# Altium project ArmPCBPrj.PrjPCB
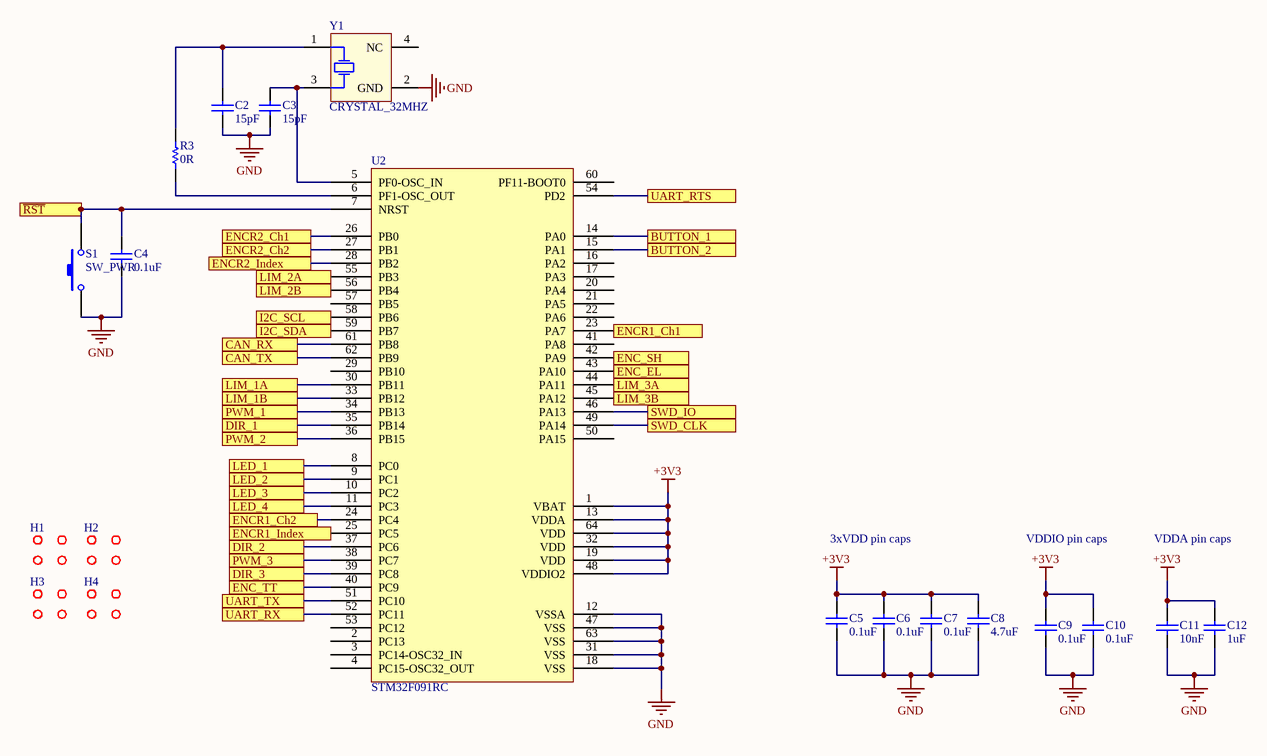
[diagram p0: MCU.SchDoc]
4 sheets, 54 parts. Net scope: flat (ports and power ports of the same name join across sheets).
Board files: ArmPCB.PcbDoc, ArmRev2.PcbDoc
Sheets:
  MCU.SchDoc
  CAN.SchDoc
  POWER.SchDoc
  Connectors.SchDoc

## Sheet MCU.SchDoc
size A4

### Parts
C2  value 15pF  [CAPC0603(1608)55_N]  (hidden comment: CAP_15pF_0603)
C3  value 15pF  [CAPC0603(1608)55_N]  (hidden comment: CAP_15pF_0603)
C4  value 0.1uF  [CAPC0603(1608)55_N]  (hidden comment: CAP_0.1uF_16V_0603)
C5  value 0.1uF  [CAPC0603(1608)55_N]  (hidden comment: CAP_0.1uF_16V_0603)
C6  value 0.1uF  [CAPC0603(1608)55_N]  (hidden comment: CAP_0.1uF_16V_0603)
C7  value 0.1uF  [CAPC0603(1608)55_N]  (hidden comment: CAP_0.1uF_16V_0603)
C8  value 4.7uF  [CAPC0603(1608)55_N]  (hidden comment: CAP_4.7uF_0603)
C9  value 0.1uF  [CAPC0603(1608)55_N]  (hidden comment: CAP_0.1uF_16V_0603)
C10  value 0.1uF  [CAPC0603(1608)55_N]  (hidden comment: CAP_0.1uF_16V_0603)
C11  value 10nF  [CAPC0603(1608)55_N]  (hidden comment: CAP_10nF_0603)
C12  value 1uF  [CAPC0603(1608)55_N]  (hidden comment: CAP_1uF_16V_0603)
H1  MOUNTING_HOLES  [MOUNTING_HOLE]  (value not drawn)
H2  MOUNTING_HOLES  [MOUNTING_HOLE]  (value not drawn)
H3  MOUNTING_HOLES  [MOUNTING_HOLE]  (value not drawn)
H4  MOUNTING_HOLES  [MOUNTING_HOLE]  (value not drawn)
R3  value 0R  [RESC0603(1608)_N]  (hidden comment: RES_0R_0603)
S1  SW_PWR  [PTS830GM140]
U2  STM32F091RC  [STM_LQFP64_N]
Y1  CRYSTAL_32MHZ  [AVX-CX2520DB32000D0GEJZ1-4_V]

### Ports
BUTTON_1, BUTTON_2, CAN_RX, CAN_TX, DIR_1, DIR_2, DIR_3, ENC_EL, ENC_SH, ENC_TT, ENCR1_Ch1, ENCR1_Ch2, ENCR1_Index, ENCR2_Ch1, ENCR2_Ch2, ENCR2_Index, I2C_SCL, I2C_SDA, LED_1, LED_2, LED_3, LED_4, LIM_1A, LIM_1B, LIM_2A, LIM_2B, LIM_3A, LIM_3B, PWM_1, PWM_2, PWM_3, SWD_CLK, SWD_IO, UART_RTS, UART_RX, UART_TX, ~{RST}

### Nets
+3V3: C5.2 C6.2 C7.2 C8.2 C9.2 C10.2 C11.2 C12.2 U2.1(VBAT) U2.13(VDDA) U2.19(VDD) U2.32(VDD) U2.48(VDDIO2) U2.64(VDD)
GND: C2.1 C3.1 C4.1 C5.1 C6.1 C7.1 C8.1 C9.1 C10.1 C11.1 C12.1 S1.1 U2.12(VSSA) U2.18(VSS) U2.31(VSS) U2.47(VSS) U2.63(VSS) Y1.2(GND)
NetC2_2: C2.2 R3.2 Y1.1(HOT)
NetC3_2: C3.2 U2.5(PF0-OSC_IN) Y1.3(HOT)
NetC4_2: C4.2 S1.2 U2.7(NRST) ; port ~{RST}
NetJ2_1: U2.34(PB13) ; port PWM_1
NetJ2_2: U2.35(PB14) ; port DIR_1
NetJ3_1: U2.36(PB15) ; port PWM_2
NetJ3_2: U2.37(PC6) ; port DIR_2
NetJ6_1: U2.38(PC7) ; port PWM_3
NetJ6_2: U2.39(PC8) ; port DIR_3
NetJ7_3: U2.25(PC5) ; port ENCR1_Index
NetJ7_4: U2.24(PC4) ; port ENCR1_Ch2
NetJ7_5: U2.23(PA7) ; port ENCR1_Ch1
NetJ8_1: U2.59(PB7) ; port I2C_SDA
NetJ8_2: U2.58(PB6) ; port I2C_SCL
NetJ9_1: U2.55(PB3) ; port LIM_2A
NetJ10_2: U2.40(PC9) ; port ENC_TT
NetJ11_2: U2.42(PA9) ; port ENC_SH
NetJ12_1: U2.30(PB11) ; port LIM_1A
NetJ13_1: U2.56(PB4) ; port LIM_2B
NetJ14_1: U2.33(PB12) ; port LIM_1B
NetJ15_2: U2.43(PA10) ; port ENC_EL
NetJ16_2: U2.51(PC10) ; port UART_TX
NetJ16_3: U2.52(PC11) ; port UART_RX
NetJ16_4: U2.54(PD2) ; port UART_RTS
NetJ16_5: U2.46(PA13) ; port SWD_IO
NetJ16_6: U2.49(PA14) ; port SWD_CLK
NetJ17_1: U2.44(PA11) ; port LIM_3A
NetJ18_3: U2.28(PB2) ; port ENCR2_Index
NetJ18_4: U2.27(PB1) ; port ENCR2_Ch2
NetJ18_5: U2.26(PB0) ; port ENCR2_Ch1
NetJ19_1: U2.45(PA12) ; port LIM_3B
NetR3_1: R3.1 U2.6(PF1-OSC_OUT)
NetU1_1: U2.62(PB9) ; port CAN_TX
NetU1_4: U2.61(PB8) ; port CAN_RX
NetU2_8: U2.8(PC0) ; port LED_1
NetU2_9: U2.9(PC1) ; port LED_2
NetU2_10: U2.10(PC2) ; port LED_3
NetU2_11: U2.11(PC3) ; port LED_4
NetU2_14: U2.14(PA0) ; port BUTTON_1
NetU2_15: U2.15(PA1) ; port BUTTON_2

Not connected (* = marked no-connect by the designer): U2 2(PC13) 3(PC14-OSC32_IN) 4(PC15-OSC32_OUT) 16(PA2) 17(PA3) 20(PA4) 21(PA5) 22(PA6) 29(PB10) 41(PA8) 50(PA15) 53(PC12) 57(PB5) 60(PF11-BOOT0); Y1 4(NC)

### Notes on the sheet
- 3xVDD pin caps
- VDDIO pin caps
- VDDA pin caps

### Library data of the parts
C2 C3 = CAP_15pF_0603: CAP CER 15PF 250V NPO 0603; Manufacturer: Yageo; MPN: AC0603JRNPOYBN150; Temperature Coefficient: NP0; Dimensions: 0.063" L x 0.031" W (1.60mm x 0.80mm); Package: 0603 (1608 Metric); Voltage Rating: 250v; Digikey Part Number: 311-3282-1-ND
C4-C7 C9 C10 = CAP_0.1uF_16V_0603: CAP CER 0.1UF 16V X7R 0603; Manufacturer: Yageo; MPN: CC0603KRX7R7BB104; Dimensions: 0.063" L x 0.031" W (1.60mm x 0.80mm); Package: 0603 (1608 Metric); Temperature Coefficient: X7R; Voltage Rating: 16V; Digikey Part Number: 311-1088-1-ND
C8 = CAP_4.7uF_0603: CAP CER 4.7UF 6.3V X5R 0603; Manufacturer: Yageo; MPN: CC0603KRX5R5BB475; Dimensions: 0.063" L x 0.031" W (1.60mm x 0.80mm); Package: 0603 (1608 Metric); Temperature Coefficient: X5R; Voltage Rating: 6.3V; Digikey Part Number: 311-1521-1-ND
C11 = CAP_10nF_0603: CAP CER 10000PF 16V X7R 0603; Manufacturer: Yageo; MPN: CC0603KRX7R7BB103; Dimensions: 0.063" L x 0.031" W (1.60mm x 0.80mm); Package: 0603 (1608 Metric); Temperature Coefficient: X7R; Voltage Rating: 16V; Digikey Part Number: 311-3369-1-ND
C12 = CAP_1uF_16V_0603: CAP CER 1UF 16V Y5V 0603; Manufacturer: Yageo; MPN: CC0603ZRY5V7BB105; Dimensions: 0.063" L x 0.031" W (1.60mm x 0.80mm); Package: 0603 (1608 Metric); Temperature Coefficient: Y5V; Voltage Rating: 16V; Digikey Part Number: 311-1372-1-ND
H1-H4 = MOUNTING_HOLES: 6cm x 6cm
R3 = RES_0R_0603: RES SMD 0 OHM JUMPER 1/10W 0603; Manufacturer: Yageo; MPN: RC0603JR-070RL; Package: 0603 (1608 Metric); Dimensions: 0.063" L x 0.031" W (1.60mm x 0.80mm); Digikey Part Number: 311-0.0GRCT-ND
S1 = SW_PWR: Power Switch (Red); pin to pad: 2>4; MPN: PTS830GM140 SMTR LFS; Manufacturer: C&K; ComponentLink1Description: Datasheet; ComponentLink1URL: https://www.ckswitches.com/media/1478/pts830.pdf; Digikey Part Number: CKN10587CT-ND
U2 = STM32F091RC: Manufacturer: STMicroelectronics; Package: 64-LQFP; ComponentLink1Description: Datasheet; ComponentLink1URL: https://www.st.com/content/ccc/resource/technical/document/datasheet/95/3c/2e/5b/21/09/45/a6/DM00115237.pdf/files/DM00115237.pdf/jcr:content/translations/en.DM00115237.pdf#%5B%7B%22num%22%3A96%2C%22gen%22%3A0%7D%2C%7B%22name%22%3A%22XYZ%22%7D%2C67%2C755%2Cnull%5D; MPN: STM32F091RC; Digikey Part Number: 497-15167-ND
Y1 = CRYSTAL_32MHZ: CRYSTAL 32MHZ 8PF SMD; Manufacturer: Kyocera International Inc. Electronic Components; MPN: CX2520DB32000D0GPSC1; Package: 4-SMD, No Lead; Dimensions: 0.098" L x 0.079" W (2.50mm x 2.00mm); Digikey Part Number: 1253-1730-1-ND

## Sheet CAN.SchDoc
size A4
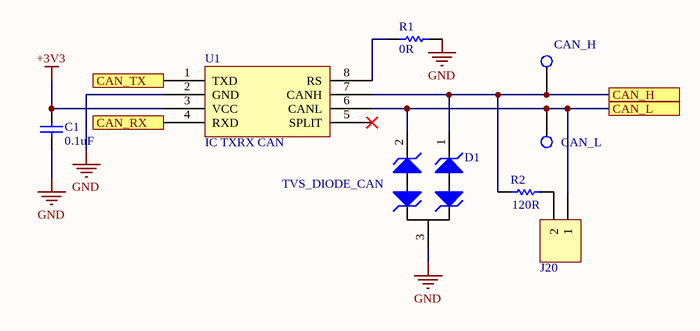
[diagram p1: CAN.SchDoc]

### Parts
C1  value 0.1uF  [CAPC0603(1608)55_N]  (hidden comment: CAP_0.1uF_16V_0603)
D1  TVS_DIODE_CAN  [TVS_DIODE_CAN]
J20  JUMPER  [HDR1X2]  (value not drawn)
R1  value 0R  [RESC0603(1608)_N]  (hidden comment: RES_0R_0603)
R2  value 120R  [RESC0603(1608)_N]  (hidden comment: RES_120R_0603)
TP1  CAN_H  [TESTPOINT_LOOP]
TP2  CAN_L  [TESTPOINT_LOOP]
U1  IC TXRX CAN  [LT-S8_N]

### Ports
CAN_H, CAN_L, CAN_RX, CAN_TX

### Nets
+3V3: C1.2 U1.3(VCC)
GND: C1.1 D1.3 R1.2 U1.2(GND)
NetD1_1: D1.1 R2.1 TP1.1 U1.7(CANH) ; port CAN_H
NetD1_2: D1.2 J20.1 TP2.1 U1.6(CANL) ; port CAN_L
NetJ20_2: J20.2 R2.2
NetR1_1: R1.1 U1.8(RS)
NetU1_1: U1.1(TXD) ; port CAN_TX
NetU1_4: U1.4(RXD) ; port CAN_RX

Not connected (* = marked no-connect by the designer): U1 5(SPLIT)*

### Library data of the parts
C1 = CAP_0.1uF_16V_0603: as C4 on sheet MCU; Dimensions: 0.063" L x 0.031" W (1.60mm x 0.80mm); Package: 0603 (1608 Metric); Temperature Coefficient: X7R; Voltage Rating: 16V; Digikey Part Number: 311-1088-1-ND
D1 = TVS_DIODE_CAN: TVS DIODE 24V 41V SOT323-3; Manufacturer: Nexperia USA Inc.; MPN: PESD2CAN,215; Package: SC-70, SOT-323; ComponentLink1Description: Datasheet; ComponentLink1URL: https://assets.nexperia.com/documents/data-sheet/PESD1CAN-U.pdf; Digikey Part Number: 1727-3891-1-ND
J20 = JUMPER_2: HEADER 2X1
R1 = RES_0R_0603: as R3 on sheet MCU; Package: 0603 (1608 Metric); Dimensions: 0.063" L x 0.031" W (1.60mm x 0.80mm); Digikey Part Number: 311-0.0GRCT-ND
R2 = RES_120R_0603: RES SMD 120 OHM 5% 1/10W 0603; Manufacturer: Yageo; MPN: RC0603JR-07120RL; Package: 0603 (1608 Metric); Dimensions: 0.063" L x 0.031" W (1.60mm x 0.80mm); Tolerance: 5%; Digikey Part Number: 311-120GRCT-ND
TP1 TP2 = TESTPOINT_LOOP: PC TEST POINT MINIATURE WHITE; Manufacturer: Keystone Electronics; MPN: 5002; Digikey Part Number: 36-5002-ND
U1 = LTC2875: IC TXRX CAN 4MBPS 8SO; Manufacturer: Linear Technologies; MPN: LTC2875IS8#PBF; Package: 8-SOIC (0.154", 3.90mm Width); ComponentLink1Description: Datasheet; ComponentLink1URL: https://www.analog.com/media/en/technical-documentation/data-sheets/2875f.pdf; Digikey Part Number: LTC2875IS8#PBF-ND

## Sheet POWER.SchDoc
size A4
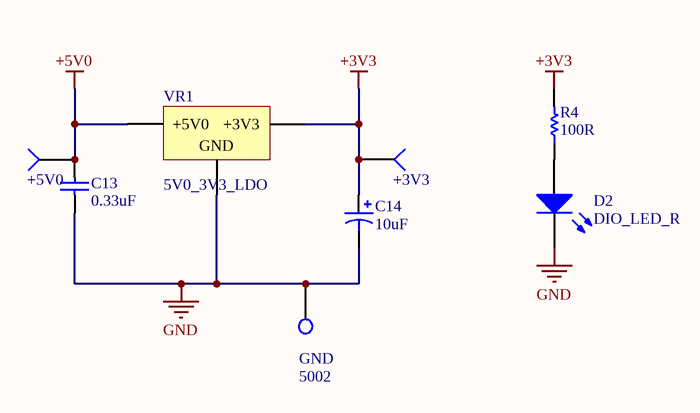
[diagram p2: POWER.SchDoc]

### Parts
C13  value 0.33uF  [CAPC0603(1608)55_N]  (hidden comment: CAP_0.33uF_16V_0603)
C14  value 10uF  [AVX-CAPC3528_V]  (hidden comment: CAP_10uF_0603_POL)
D2  DIO_LED_R  [LED_0805_LINE]
R4  value 100R  [RESC0603(1608)_N]  (hidden comment: RES_100R_0603)
TP3  +5V0  [TESTPOINT]
TP4  +3V3  [TESTPOINT]
TP5  GND  MPN: 5002  [TESTPOINT_LOOP]
VR1  5V0_3V3_LDO  [VOLTAGE_REGULATOR]

### Nets
+3V3: C14.1 R4.2 TP4.1(=value) VR1.2(+3V3)
+5V0: C13.2 TP3.1(=value) VR1.3(+5V0)
GND: C13.1 C14.2 D2.2(K) TP5.1(=value) VR1.1(GND)
NetD2_1: D2.1(A) R4.1

### Library data of the parts
C13 = CAP_0.33uF_16V_0603: CAP CER 0.33UF 16V X7R 0603; MPN: GCM188R71C334KA37D; Manufacturer: Murata Electronics North America; Dimensions: 0.063" L x 0.031" W (1.60mm x 0.80mm); Package: 0603 (1608 Metric); Temperature Coefficient: X7R; Voltage Rating: 16V; Digikey Part Number: 490-6050-1-ND
C14 = CAP_10uF_0603_POL: Capacitor, Tantalum, 10uF 10% 20V MCCT-B (3528); MPN: CC0603MRX5R6BB106; Manufacturer: Yageo; Temperature Coefficient: X5R; Voltage Rating: 10V; Dimensions: 0.063" L x 0.031" W (1.60mm x 0.80mm); Package: 0603 (1608 Metric); Digikey Part Number: 311-1817-1-ND
D2 = DIO_LED_R: LED RED DIFFUSED 0805 SMD; Manufacturer: OSRAM; MPN: LS R976-NR-1; Forward Voltage Drop: 2V; Package: 0805 (2012 Metric); Digikey Part Number: 475-1278-1-ND
R4 = RES_100R_0603: RES SMD 100 OHM 1% 1/10W 0603; Manufacturer: Yageo; MPN: RC0603FR-07100RL; Package: 0603 (1608 Metric); Dimensions: 0.063" L x 0.031" W (1.60mm x 0.80mm); Tolerance: 1%; Digikey Part Number: 311-100HRCT-ND
TP3 TP4 = TESTPOINT_SMD: Part Number (MPN): *
TP5 = TESTPOINT_LOOP: PC TEST POINT MINIATURE WHITE; Manufacturer: Keystone Electronics; Digikey Part Number: 36-5002-ND
VR1 = 5V0_3V3_LDO: IC REG LINEAR 3.3V 1A DPAK; Manufacturer: ON Semiconductor; MPN: NCP1117DT33T5G; Current Output: 1A; Digikey Part Number: NCP1117DT33T5GOSCT-ND

## Sheet Connectors.SchDoc
size A4
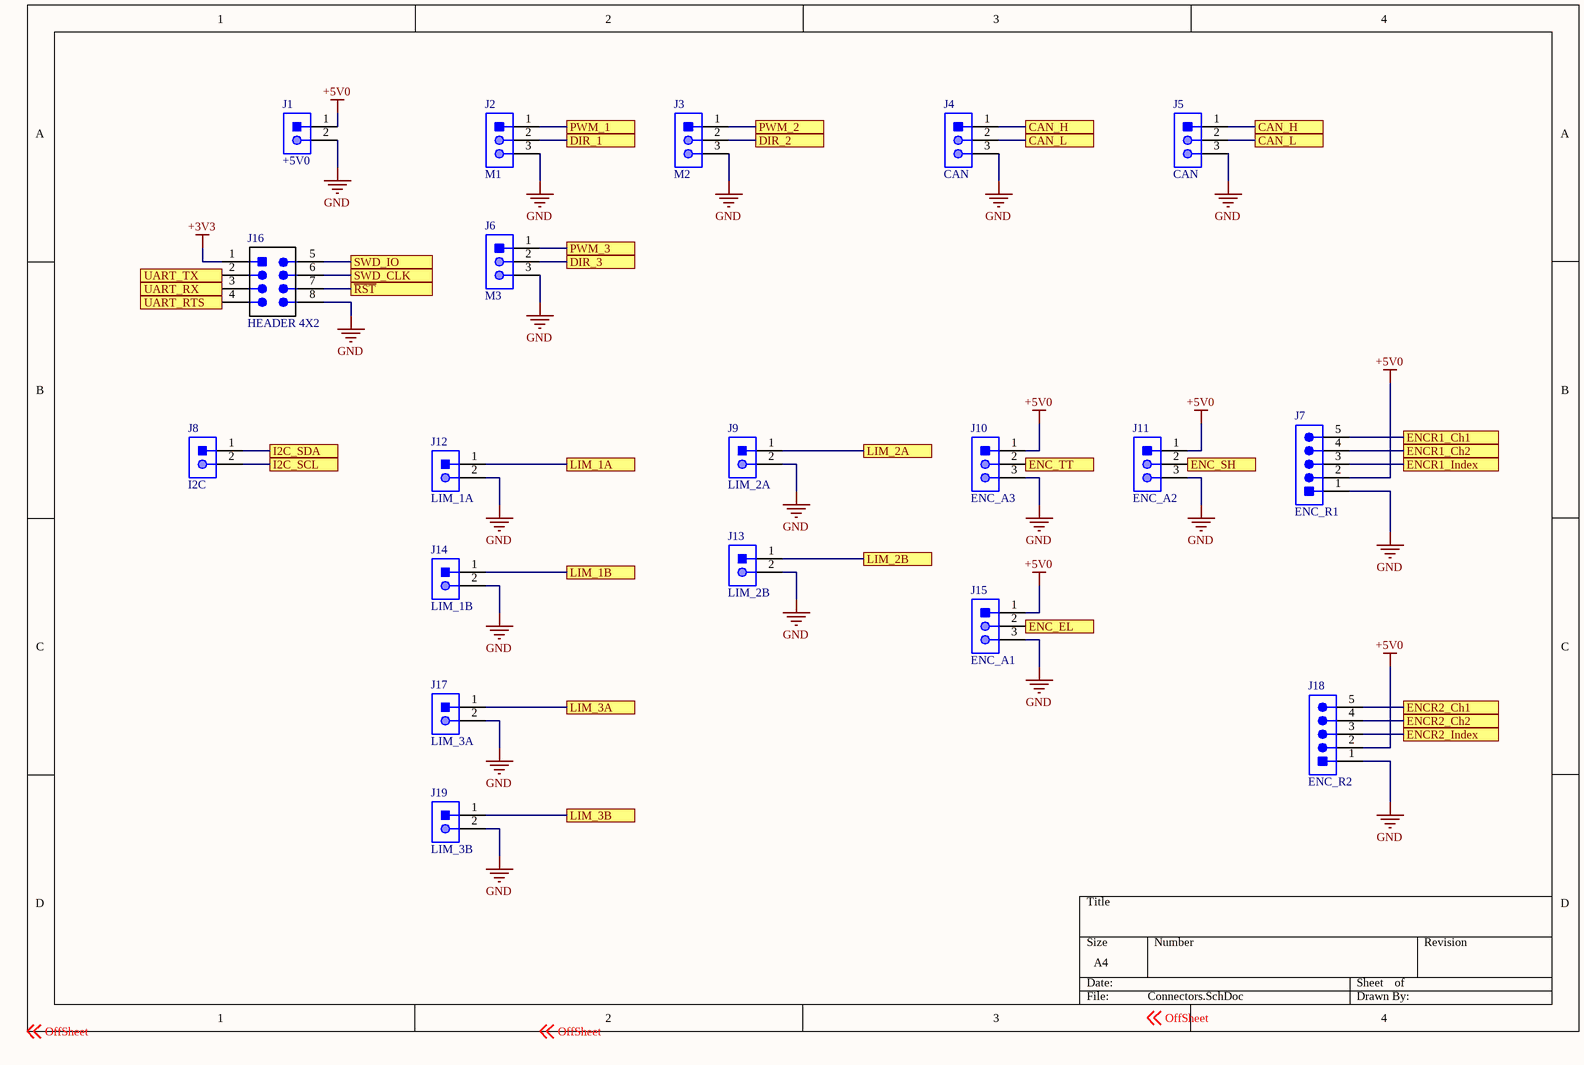
[diagram p3: Connectors.SchDoc]

### Parts
J1  +5V0  [JST-B2B-SM4-TB]
J2  M1  [JST-B3B-SM4-TB]
J3  M2  [JST-B3B-SM4-TB]
J4  CAN  [JST-B3B-SM4-TB]
J5  CAN  [JST-B3B-SM4-TB]
J6  M3  [JST-B3B-SM4-TB]
J7  ENC_R1  [JST-B5B-SM4-TB]
J8  I2C  [JST-B2B-SM4-TB]
J9  LIM_2A  [JST-B2B-SM4-TB]
J10  ENC_A3  [JST-B3B-SM4-TB]
J11  ENC_A2  [JST-B3B-SM4-TB]
J12  LIM_1A  [JST-B2B-SM4-TB]
J13  LIM_2B  [JST-B2B-SM4-TB]
J14  LIM_1B  [JST-B2B-SM4-TB]
J15  ENC_A1  [JST-B3B-SM4-TB]
J16  HEADER 4X2  [HEADER_2X4]
J17  LIM_3A  [JST-B2B-SM4-TB]
J18  ENC_R2  [JST-B5B-SM4-TB]
J19  LIM_3B  [JST-B2B-SM4-TB]

### Ports
CAN_H, CAN_L, DIR_1, DIR_2, DIR_3, ENC_EL, ENC_SH, ENC_TT, ENCR1_Ch1, ENCR1_Ch2, ENCR1_Index, ENCR2_Ch1, ENCR2_Ch2, ENCR2_Index, I2C_SCL, I2C_SDA, LIM_1A, LIM_1B, LIM_2A, LIM_2B, LIM_3A, LIM_3B, PWM_1, PWM_2, PWM_3, SWD_CLK, SWD_IO, UART_RTS, UART_RX, UART_TX, ~{RST}

### Nets
+3V3: J16.1(VCC)
+5V0: J1.1 J7.2 J10.1 J11.1 J15.1 J18.2
GND: J1.2 J2.3 J3.3 J4.3 J5.3 J6.3 J7.1 J9.2 J10.3 J11.3 J12.2 J13.2 J14.2 J15.3 J16.8 J17.2 J18.1 J19.2
NetC4_2: J16.7 ; port ~{RST}
NetD1_1: J4.1 J5.1 ; port CAN_H
NetD1_2: J4.2 J5.2 ; port CAN_L
NetJ2_1: J2.1 ; port PWM_1
NetJ2_2: J2.2 ; port DIR_1
NetJ3_1: J3.1 ; port PWM_2
NetJ3_2: J3.2 ; port DIR_2
NetJ6_1: J6.1 ; port PWM_3
NetJ6_2: J6.2 ; port DIR_3
NetJ7_3: J7.3 ; port ENCR1_Index
NetJ7_4: J7.4 ; port ENCR1_Ch2
NetJ7_5: J7.5 ; port ENCR1_Ch1
NetJ8_1: J8.1 ; port I2C_SDA
NetJ8_2: J8.2 ; port I2C_SCL
NetJ9_1: J9.1 ; port LIM_2A
NetJ10_2: J10.2 ; port ENC_TT
NetJ11_2: J11.2 ; port ENC_SH
NetJ12_1: J12.1 ; port LIM_1A
NetJ13_1: J13.1 ; port LIM_2B
NetJ14_1: J14.1 ; port LIM_1B
NetJ15_2: J15.2 ; port ENC_EL
NetJ16_2: J16.2 ; port UART_TX
NetJ16_3: J16.3 ; port UART_RX
NetJ16_4: J16.4 ; port UART_RTS
NetJ16_5: J16.5(GND) ; port SWD_IO
NetJ16_6: J16.6 ; port SWD_CLK
NetJ17_1: J17.1 ; port LIM_3A
NetJ18_3: J18.3 ; port ENCR2_Index
NetJ18_4: J18.4 ; port ENCR2_Ch2
NetJ18_5: J18.5 ; port ENCR2_Ch1
NetJ19_1: J19.1 ; port LIM_3B

### Notes on the sheet
- Labels drawn without touching a wire or pin: OffSheet

### Library data of the parts
J1 J8 J9 J12-J14 J17 J19 = CON_2M_PH_TOP_SMT: CONN HEADER PH TOP 2POS 2MM SMD; Manufacturer: JST; MPN: B2B-PH-SM4-TB; ComponentLink1Description: Datasheet; ComponentLink1URL: http://www.jst-mfg.com/product/pdf/eng/ePH.pdf; Digikey Part Number: 455-1734-1-ND
J2-J6 J10 J11 J15 = CON_3M_PH_TOP_SMT: CONN HEADER PH TOP 3POS 2MM SMD; Manufacturer: JST; MPN: B3B-PH-SM4-TB(LF)(SN); ComponentLink1Description: Datasheet; ComponentLink1URL: http://www.jst-mfg.com/product/pdf/eng/ePH.pdf; Digikey Part Number: 455-1735-1-ND
J7 J18 = CON_5M_PH_TOP_SMT: CONN HEADER PH TOP 5POS 2MM SMD; Manufacturer: JST; MPN: B5B-PH-SM4-TB(LF)(SN); ComponentLink1Description: Datasheet; ComponentLink1URL: http://www.jst-mfg.com/product/pdf/eng/ePH.pdf; Digikey Part Number: 455-1737-1-ND
J16 = HEADER 4X2: Header, 4-Pin Dual row; MPN: GRPB042VWVN-RC; Manufacturer: Sullins Connector Solutions; Digikey Part Number: S9015E-04-ND

## Nets that join several sheets
+3V3: MCU (14 pins), CAN (C1.2 U1.3), POWER (C14.1 R4.2 TP4.1 VR1.2), Connectors (J16.1)
+5V0: POWER (C13.2 TP3.1 VR1.3), Connectors (6 pins)
GND: MCU (18 pins), CAN (C1.1 D1.3 R1.2 U1.2), POWER (5 pins), Connectors (18 pins)
NetC4_2: MCU (C4.2 S1.2 U2.7), Connectors (J16.7)
NetD1_1: CAN (D1.1 R2.1 TP1.1 U1.7), Connectors (J4.1 J5.1)
NetD1_2: CAN (D1.2 J20.1 TP2.1 U1.6), Connectors (J4.2 J5.2)
NetJ2_1: MCU (U2.34), Connectors (J2.1)
NetJ2_2: MCU (U2.35), Connectors (J2.2)
NetJ3_1: MCU (U2.36), Connectors (J3.1)
NetJ3_2: MCU (U2.37), Connectors (J3.2)
NetJ6_1: MCU (U2.38), Connectors (J6.1)
NetJ6_2: MCU (U2.39), Connectors (J6.2)
NetJ7_3: MCU (U2.25), Connectors (J7.3)
NetJ7_4: MCU (U2.24), Connectors (J7.4)
NetJ7_5: MCU (U2.23), Connectors (J7.5)
NetJ8_1: MCU (U2.59), Connectors (J8.1)
NetJ8_2: MCU (U2.58), Connectors (J8.2)
NetJ9_1: MCU (U2.55), Connectors (J9.1)
NetJ10_2: MCU (U2.40), Connectors (J10.2)
NetJ11_2: MCU (U2.42), Connectors (J11.2)
NetJ12_1: MCU (U2.30), Connectors (J12.1)
NetJ13_1: MCU (U2.56), Connectors (J13.1)
NetJ14_1: MCU (U2.33), Connectors (J14.1)
NetJ15_2: MCU (U2.43), Connectors (J15.2)
NetJ16_2: MCU (U2.51), Connectors (J16.2)
NetJ16_3: MCU (U2.52), Connectors (J16.3)
NetJ16_4: MCU (U2.54), Connectors (J16.4)
NetJ16_5: MCU (U2.46), Connectors (J16.5)
NetJ16_6: MCU (U2.49), Connectors (J16.6)
NetJ17_1: MCU (U2.44), Connectors (J17.1)
NetJ18_3: MCU (U2.28), Connectors (J18.3)
NetJ18_4: MCU (U2.27), Connectors (J18.4)
NetJ18_5: MCU (U2.26), Connectors (J18.5)
NetJ19_1: MCU (U2.45), Connectors (J19.1)
NetU1_1: MCU (U2.62), CAN (U1.1)
NetU1_4: MCU (U2.61), CAN (U1.4)